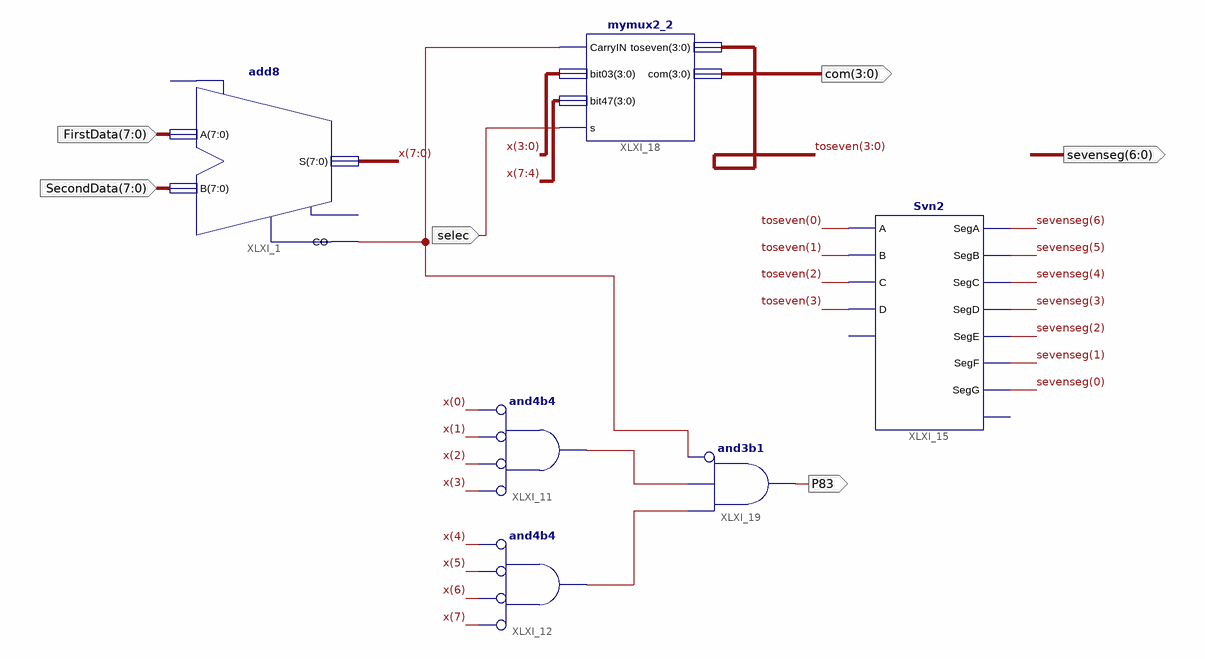
[diagram p0: schematic sheet 1]
// Xilinx ISE schematic display.sch (spartan6) as structural Verilog: 6 symbols, 6 ports
module display (
  input  [7:0] FirstData,
  input  [7:0] SecondData,
  input  selec,
  output [6:0] sevenseg,
  output [3:0] com,
  output P83
);

  wire XLXN_15, XLXN_16, XLXN_20;
  wire [3:0] toseven;
  wire [7:0] x;

  add8 XLXI_1 (.A(FirstData), .B(SecondData), .CO(XLXN_20), .S(x));  // open: CI, OFL
  and XLXI_11 (XLXN_15, ~x[3], ~x[2], ~x[1], ~x[0]);  // and4b4
  and XLXI_12 (XLXN_16, ~x[7], ~x[6], ~x[5], ~x[4]);  // and4b4
  Svn2 XLXI_15 (
    .A(toseven[0]), .B(toseven[1]), .C(toseven[2]), .D(toseven[3]), .SegA(sevenseg[6]), .SegB(sevenseg[5]),
    .SegC(sevenseg[4]), .SegD(sevenseg[3]), .SegE(sevenseg[2]), .SegF(sevenseg[1]), .SegG(sevenseg[0]));  // open: P, SegP
  mymux2_2 XLXI_18 (.bit03(x[3:0]), .bit47(x[7:4]), .CarryIN(XLXN_20), .com(com), .s(selec), .toseven(toseven));
  and XLXI_19 (P83, ~XLXN_20, XLXN_15, XLXN_16);  // and3b1
endmodule
